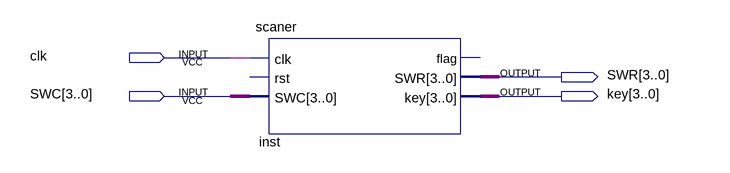
[diagram p0: schematic sheet]
// Quartus schematic Eleventh.bdf as structural Verilog: 1 symbols, 4 pins
module Eleventh (
  input  clk,
  input  [3:0] SWC,
  output [3:0] SWR,
  output [3:0] key
);

  scaner inst (.clk(clk), .SWC(SWC), .SWR(SWR), .key(key));  // open: rst, flag
endmodule
